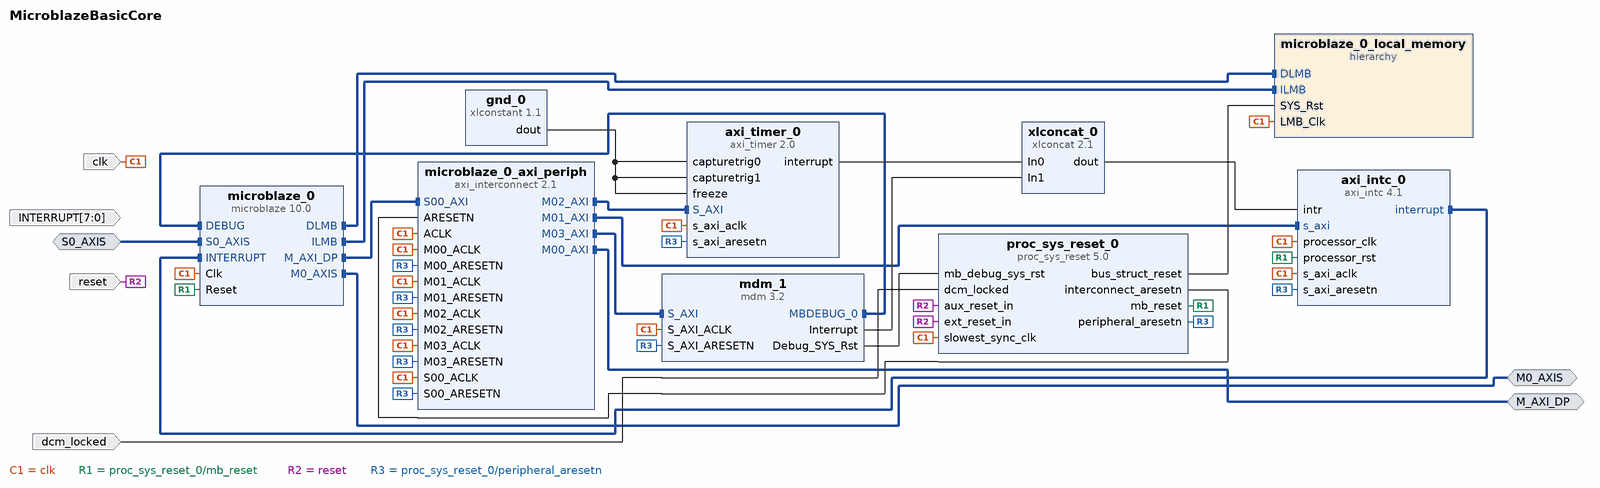
[diagram p0: block diagram of the top level]
# Vivado block design MicroblazeBasicCore, xc7a200tfbg676-2, Vivado 2016.3
create_bd_design MicroblazeBasicCore

create_bd_intf_port -mode Master -vlnv xilinx.com:interface:aximm_rtl:1.0 M_AXI_DP
set_property -dict [list \
  CONFIG.DATA_WIDTH 32 \
  CONFIG.PROTOCOL AXI4LITE \
  CONFIG.ADDR_WIDTH 32 \
  CONFIG.HAS_BURST 0 \
  CONFIG.HAS_LOCK 0 \
  CONFIG.HAS_PROT 0 \
  CONFIG.HAS_CACHE 0 \
  CONFIG.HAS_QOS 0 \
  CONFIG.HAS_REGION 0 \
  CONFIG.HAS_WSTRB 0 \
  CONFIG.NUM_READ_OUTSTANDING 0 \
  CONFIG.NUM_WRITE_OUTSTANDING 0 \
] [get_bd_intf_ports M_AXI_DP]
create_bd_intf_port -mode Master -vlnv xilinx.com:interface:axis_rtl:1.0 M0_AXIS
create_bd_intf_port -mode Slave -vlnv xilinx.com:interface:axis_rtl:1.0 S0_AXIS
set_property -dict [list \
  CONFIG.TDATA_NUM_BYTES 4 \
  CONFIG.TDEST_WIDTH 0 \
  CONFIG.TID_WIDTH 0 \
  CONFIG.TUSER_WIDTH 0 \
  CONFIG.HAS_TREADY 1 \
  CONFIG.HAS_TSTRB 0 \
  CONFIG.HAS_TKEEP 0 \
  CONFIG.HAS_TLAST 1 \
  CONFIG.LAYERED_METADATA undef \
] [get_bd_intf_ports S0_AXIS]
create_bd_port -dir I -type clk clk
create_bd_port -dir I -type rst reset
set_property -dict {CONFIG.POLARITY ACTIVE_HIGH} [get_bd_ports reset]
create_bd_port -dir I dcm_locked
create_bd_port -dir I -from 7 -to 0 -type intr INTERRUPT
set_property -dict {CONFIG.SENSITIVITY LEVEL_HIGH CONFIG.PortWidth 8} [get_bd_ports INTERRUPT]

create_bd_cell -type ip -vlnv xilinx.com:ip:microblaze:10.0 microblaze_0
set_property -dict [list \
  CONFIG.C_D_AXI 1 \
  CONFIG.C_D_LMB 1 \
  CONFIG.C_I_LMB 1 \
  CONFIG.C_USE_MSR_INSTR 1 \
  CONFIG.C_USE_PCMP_INSTR 1 \
  CONFIG.C_USE_BARREL 1 \
  CONFIG.C_USE_DIV 1 \
  CONFIG.C_USE_HW_MUL 2 \
  CONFIG.C_USE_FPU 2 \
  CONFIG.C_DEBUG_ENABLED 1 \
  CONFIG.C_NUMBER_OF_PC_BRK 4 \
  CONFIG.C_FSL_LINKS 1 \
  CONFIG.C_USE_EXTENDED_FSL_INSTR 1 \
  CONFIG.C_USE_INTERRUPT 2 \
] [get_bd_cells microblaze_0]
create_bd_cell -type hier microblaze_0_local_memory
create_bd_cell -type ip -vlnv xilinx.com:ip:mdm:3.2 mdm_1
set_property -dict {CONFIG.C_USE_UART 1} [get_bd_cells mdm_1]
create_bd_cell -type ip -vlnv xilinx.com:ip:proc_sys_reset:5.0 proc_sys_reset_0
set_property -dict [list \
  CONFIG.C_AUX_RESET_HIGH 1 \
  CONFIG.C_AUX_RST_WIDTH 1 \
  CONFIG.C_EXT_RST_WIDTH 1 \
  CONFIG.USE_BOARD_FLOW true \
  CONFIG.RESET_BOARD_INTERFACE Custom \
] [get_bd_cells proc_sys_reset_0]
create_bd_cell -type ip -vlnv xilinx.com:ip:axi_interconnect:2.1 microblaze_0_axi_periph
set_property -dict {CONFIG.NUM_MI 4} [get_bd_cells microblaze_0_axi_periph]
create_bd_cell -type ip -vlnv xilinx.com:ip:axi_timer:2.0 axi_timer_0
create_bd_cell -type ip -vlnv xilinx.com:ip:xlconstant:1.1 gnd_0
set_property -dict {CONFIG.CONST_VAL 0} [get_bd_cells gnd_0]
create_bd_cell -type ip -vlnv xilinx.com:ip:xlconcat:2.1 xlconcat_0
set_property -dict {CONFIG.NUM_PORTS 2 CONFIG.IN2_WIDTH 1} [get_bd_cells xlconcat_0]
create_bd_cell -type ip -vlnv xilinx.com:ip:axi_intc:4.1 axi_intc_0
set_property -dict {CONFIG.C_NUM_SW_INTR 10 CONFIG.C_IRQ_IS_LEVEL 0 CONFIG.C_HAS_FAST 1} [get_bd_cells axi_intc_0]

# ---- hierarchy /microblaze_0_local_memory ----
current_bd_instance /microblaze_0_local_memory
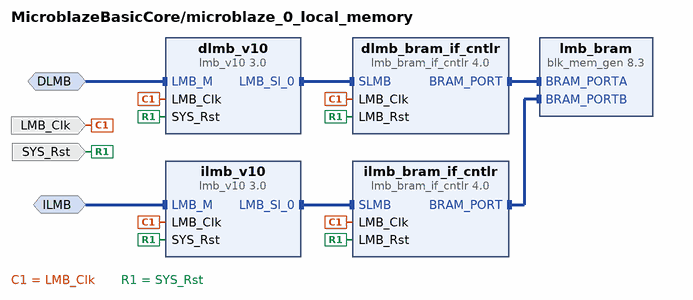
[diagram p1: block diagram inside /microblaze_0_local_memory]
create_bd_intf_pin -mode MirroredMaster -vlnv xilinx.com:interface:lmb_rtl:1.0 DLMB
create_bd_intf_pin -mode MirroredMaster -vlnv xilinx.com:interface:lmb_rtl:1.0 ILMB
create_bd_pin -dir I -type clk LMB_Clk
create_bd_pin -dir I -type rst SYS_Rst

create_bd_cell -type ip -vlnv xilinx.com:ip:lmb_v10:3.0 dlmb_v10
create_bd_cell -type ip -vlnv xilinx.com:ip:lmb_v10:3.0 ilmb_v10
create_bd_cell -type ip -vlnv xilinx.com:ip:lmb_bram_if_cntlr:4.0 dlmb_bram_if_cntlr
set_property -dict {CONFIG.C_ECC 0} [get_bd_cells dlmb_bram_if_cntlr]
create_bd_cell -type ip -vlnv xilinx.com:ip:lmb_bram_if_cntlr:4.0 ilmb_bram_if_cntlr
set_property -dict {CONFIG.C_ECC 0} [get_bd_cells ilmb_bram_if_cntlr]
create_bd_cell -type ip -vlnv xilinx.com:ip:blk_mem_gen:8.3 lmb_bram
set_property -dict {CONFIG.Memory_Type True_Dual_Port_RAM CONFIG.use_bram_block BRAM_Controller} [get_bd_cells lmb_bram]

# ---- connections ----

current_bd_instance /microblaze_0_local_memory
connect_bd_intf_net -intf_net microblaze_0_dlmb_bus [get_bd_intf_pins dlmb_v10/LMB_Sl_0] [get_bd_intf_pins dlmb_bram_if_cntlr/SLMB]
connect_bd_intf_net -intf_net microblaze_0_ilmb_bus [get_bd_intf_pins ilmb_v10/LMB_Sl_0] [get_bd_intf_pins ilmb_bram_if_cntlr/SLMB]
connect_bd_intf_net -intf_net microblaze_0_dlmb_cntlr [get_bd_intf_pins dlmb_bram_if_cntlr/BRAM_PORT] [get_bd_intf_pins lmb_bram/BRAM_PORTA]
connect_bd_intf_net -intf_net microblaze_0_ilmb_cntlr [get_bd_intf_pins ilmb_bram_if_cntlr/BRAM_PORT] [get_bd_intf_pins lmb_bram/BRAM_PORTB]
connect_bd_intf_net -intf_net microblaze_0_dlmb [get_bd_intf_pins DLMB] [get_bd_intf_pins dlmb_v10/LMB_M]
connect_bd_intf_net -intf_net microblaze_0_ilmb [get_bd_intf_pins ILMB] [get_bd_intf_pins ilmb_v10/LMB_M]
connect_bd_net -net microblaze_0_Clk [get_bd_pins LMB_Clk] \
  [get_bd_pins dlmb_v10/LMB_Clk] [get_bd_pins dlmb_bram_if_cntlr/LMB_Clk] [get_bd_pins ilmb_v10/LMB_Clk] \
  [get_bd_pins ilmb_bram_if_cntlr/LMB_Clk]
connect_bd_net [get_bd_pins SYS_Rst] \
  [get_bd_pins dlmb_v10/SYS_Rst] [get_bd_pins dlmb_bram_if_cntlr/LMB_Rst] [get_bd_pins ilmb_v10/SYS_Rst] \
  [get_bd_pins ilmb_bram_if_cntlr/LMB_Rst]

current_bd_instance /
connect_bd_intf_net [get_bd_intf_pins microblaze_0/DLMB] [get_bd_intf_pins microblaze_0_local_memory/DLMB]
connect_bd_intf_net [get_bd_intf_pins microblaze_0/ILMB] [get_bd_intf_pins microblaze_0_local_memory/ILMB]
connect_bd_intf_net [get_bd_intf_pins mdm_1/MBDEBUG_0] [get_bd_intf_pins microblaze_0/DEBUG]
connect_bd_intf_net [get_bd_intf_pins microblaze_0/M_AXI_DP] [get_bd_intf_pins microblaze_0_axi_periph/S00_AXI]
connect_bd_intf_net [get_bd_intf_pins microblaze_0_axi_periph/M02_AXI] [get_bd_intf_pins axi_timer_0/S_AXI]
connect_bd_intf_net [get_bd_intf_pins microblaze_0_axi_periph/M03_AXI] [get_bd_intf_pins mdm_1/S_AXI]
connect_bd_intf_net [get_bd_intf_pins axi_intc_0/interrupt] [get_bd_intf_pins microblaze_0/INTERRUPT]
connect_bd_intf_net [get_bd_intf_pins axi_intc_0/s_axi] [get_bd_intf_pins microblaze_0_axi_periph/M01_AXI]
connect_bd_intf_net [get_bd_intf_ports M_AXI_DP] [get_bd_intf_pins microblaze_0_axi_periph/M00_AXI]
connect_bd_intf_net [get_bd_intf_ports M0_AXIS] [get_bd_intf_pins microblaze_0/M0_AXIS]
connect_bd_intf_net [get_bd_intf_ports S0_AXIS] [get_bd_intf_pins microblaze_0/S0_AXIS]
connect_bd_net -net microblaze_0_Clk [get_bd_ports clk] \
  [get_bd_pins microblaze_0/Clk] [get_bd_pins proc_sys_reset_0/slowest_sync_clk] [get_bd_pins axi_timer_0/s_axi_aclk] \
  [get_bd_pins mdm_1/S_AXI_ACLK] [get_bd_pins axi_intc_0/s_axi_aclk] [get_bd_pins axi_intc_0/processor_clk] \
  [get_bd_pins microblaze_0_local_memory/LMB_Clk] [get_bd_pins microblaze_0_axi_periph/S00_ACLK] \
  [get_bd_pins microblaze_0_axi_periph/ACLK] [get_bd_pins microblaze_0_axi_periph/M00_ACLK] \
  [get_bd_pins microblaze_0_axi_periph/M01_ACLK] [get_bd_pins microblaze_0_axi_periph/M02_ACLK] \
  [get_bd_pins microblaze_0_axi_periph/M03_ACLK]
connect_bd_net -net rst_clk_wiz_1_100M_mb_reset [get_bd_pins proc_sys_reset_0/mb_reset] \
  [get_bd_pins microblaze_0/Reset] [get_bd_pins axi_intc_0/processor_rst]
connect_bd_net -net rst_clk_wiz_1_100M_bus_struct_reset [get_bd_pins proc_sys_reset_0/bus_struct_reset] \
  [get_bd_pins microblaze_0_local_memory/SYS_Rst]
connect_bd_net [get_bd_pins mdm_1/Debug_SYS_Rst] [get_bd_pins proc_sys_reset_0/mb_debug_sys_rst]
connect_bd_net [get_bd_ports reset] [get_bd_pins proc_sys_reset_0/ext_reset_in] [get_bd_pins proc_sys_reset_0/aux_reset_in]
connect_bd_net -net rst_clk_wiz_1_100M_peripheral_aresetn [get_bd_pins proc_sys_reset_0/peripheral_aresetn] \
  [get_bd_pins axi_timer_0/s_axi_aresetn] [get_bd_pins mdm_1/S_AXI_ARESETN] [get_bd_pins axi_intc_0/s_axi_aresetn] \
  [get_bd_pins microblaze_0_axi_periph/S00_ARESETN] [get_bd_pins microblaze_0_axi_periph/M00_ARESETN] \
  [get_bd_pins microblaze_0_axi_periph/M01_ARESETN] [get_bd_pins microblaze_0_axi_periph/M03_ARESETN] \
  [get_bd_pins microblaze_0_axi_periph/M02_ARESETN]
connect_bd_net -net rst_clk_wiz_1_100M_interconnect_aresetn [get_bd_pins proc_sys_reset_0/interconnect_aresetn] \
  [get_bd_pins microblaze_0_axi_periph/ARESETN]
connect_bd_net [get_bd_ports dcm_locked] [get_bd_pins proc_sys_reset_0/dcm_locked]
connect_bd_net [get_bd_pins gnd_0/dout] [get_bd_pins axi_timer_0/capturetrig0] [get_bd_pins axi_timer_0/capturetrig1] [get_bd_pins axi_timer_0/freeze]
connect_bd_net [get_bd_pins xlconcat_0/dout] [get_bd_pins axi_intc_0/intr]
connect_bd_net [get_bd_pins axi_timer_0/interrupt] [get_bd_pins xlconcat_0/In0]
connect_bd_net [get_bd_pins mdm_1/Interrupt] [get_bd_pins xlconcat_0/In1]

# ---- address map ----
assign_bd_address -offset 0x00000000 -range 32K -target_address_space [get_bd_addr_spaces microblaze_0/Data] [get_bd_addr_segs microblaze_0_local_memory/dlmb_bram_if_cntlr/SLMB/Mem]
assign_bd_address -offset 0x00010000 -range 64K -target_address_space [get_bd_addr_spaces microblaze_0/Data] [get_bd_addr_segs axi_intc_0/S_AXI/Reg]
assign_bd_address -offset 0x00020000 -range 64K -target_address_space [get_bd_addr_spaces microblaze_0/Data] [get_bd_addr_segs axi_timer_0/S_AXI/Reg]
assign_bd_address -offset 0x00030000 -range 64K -target_address_space [get_bd_addr_spaces microblaze_0/Data] [get_bd_addr_segs mdm_1/S_AXI/Reg]
assign_bd_address -offset 0x80000000 -range 2G -target_address_space [get_bd_addr_spaces microblaze_0/Data] [get_bd_addr_segs M_AXI_DP/Reg]
assign_bd_address -offset 0x00000000 -range 32K -target_address_space [get_bd_addr_spaces microblaze_0/Instruction] [get_bd_addr_segs microblaze_0_local_memory/ilmb_bram_if_cntlr/SLMB/Mem]

validate_bd_design
save_bd_design
